# Altium schematic sheet controle_motor_comunicacao.SchDoc
size A4; SheetNumber: 2; SheetTotal: 4
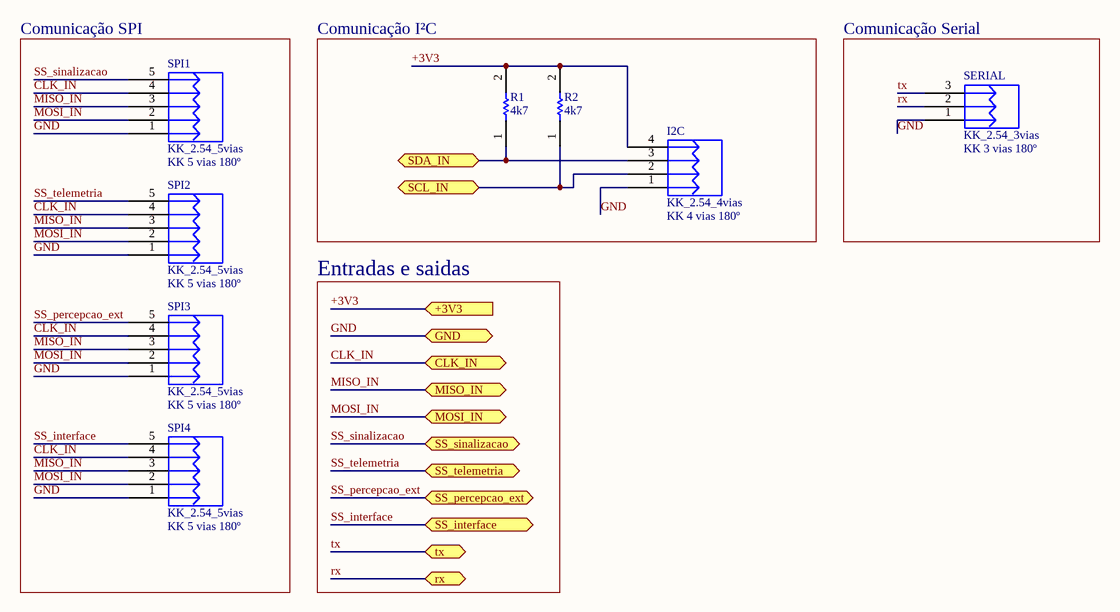
[diagram p0: controle_motor_comunicacao.SchDoc]

## Parts
I2C  KK_2.54_4vias  Valor: KK 4 vias 180º  [KK_4vias_180°]
R1  4k7  [RESC3216X60N]
R2  4k7  [RESC3216X60N]
SERIAL  KK_2.54_3vias  Valor: KK 3 vias 180º  [KK_3vias_180º]
SPI1  KK_2.54_5vias  Valor: KK 5 vias 180º  [KK_5vias_180°]
SPI2  KK_2.54_5vias  Valor: KK 5 vias 180º  [KK_5vias_180°]
SPI3  KK_2.54_5vias  Valor: KK 5 vias 180º  [KK_5vias_180°]
SPI4  KK_2.54_5vias  Valor: KK 5 vias 180º  [KK_5vias_180°]

## Blocks framed on the sheet
Comunicação SPI: SPI1-SPI4
Comunicação I²C: I2C R1 R2
Comunicação Serial: SERIAL

## Ports
+3V3 (in), CLK_IN (bidir), GND (bidir), MISO_IN (bidir), MOSI_IN (bidir), rx (bidir), SCL_IN (bidir), SDA_IN (bidir), SS_interface (bidir), SS_percepcao_ext (bidir), SS_sinalizacao (bidir), SS_telemetria (bidir), tx (bidir)

## Nets
+3V3: I2C.4 R1.2 R2.2 ; port +3V3
CLK_IN: SPI1.4 SPI2.4 SPI3.4 SPI4.4 ; port CLK_IN
GND: I2C.1 SERIAL.1 SPI1.1 SPI2.1 SPI3.1 SPI4.1 ; port GND
MISO_IN: SPI1.3 SPI2.3 SPI3.3 SPI4.3 ; port MISO_IN
MOSI_IN: SPI1.2 SPI2.2 SPI3.2 SPI4.2 ; port MOSI_IN
rx: SERIAL.2 ; port rx
SCL_IN: I2C.2 R2.1 ; port SCL_IN
SDA_IN: I2C.3 R1.1 ; port SDA_IN
SS_interface: SPI4.5 ; port SS_interface
SS_percepcao_ext: SPI3.5 ; port SS_percepcao_ext
SS_sinalizacao: SPI1.5 ; port SS_sinalizacao
SS_telemetria: SPI2.5 ; port SS_telemetria
tx: SERIAL.3 ; port tx

## Notes on the sheet
- Entradas e saidas

## Library data of the parts
I2C = KK_2.54_4vias: Conector KK 2.54mm 4 vias; Descrição: Conector KK 3 vias com passo 2.54mm; Encapsulamento: PTH - 180º; Modelo: 3 vias - 180º; Marca: *; Observação: *
R1 R2 = RES 1206: RES 1206 5%; Manufacturer_Name: Vishay; Manufacturer_Part_Number: CRCW12064K70FKEA; Datasheet Link: http://docs-emea.rs-online.com/webdocs/13ec/0900766b813ecc08.pdf; Height: 0.6mm; Mouser Part Number: 71-CRCW1206-4.7K-E3; Mouser Price/Stock: https://www.mouser.co.uk/ProductDetail/Vishay-Dale/CRCW12064K70FKEA?qs=1vm4qhDHCvlKJmatsKzyFQ%3D%3D; Arrow Part Number: CRCW12064K70FKEA; Arrow Price/Stock: https://www.arrow.com/en/products/crcw12064k70fkea/vishay
SERIAL = KK_2.54_3vias: Conector KK 2.54mm 3 vias; Descrição: Conector KK 3 vias com passo 2.54mm; Encapsulamento: PTH - 180º; Modelo: 3 vias - 180º; Marca: *; Observação: *
SPI1-SPI4 = KK_2.54_5vias: Conector KK 2.54mm 5 vias; Descrição: Conector KK 3 vias com passo 2.54mm; Encapsulamento: PTH - 180º; Modelo: 3 vias - 180º; Marca: *; Observação: *